# Altium schematic sheet Microcontroller CPU.SchDoc
size A4; SheetNumber: 2; SheetTotal: 5
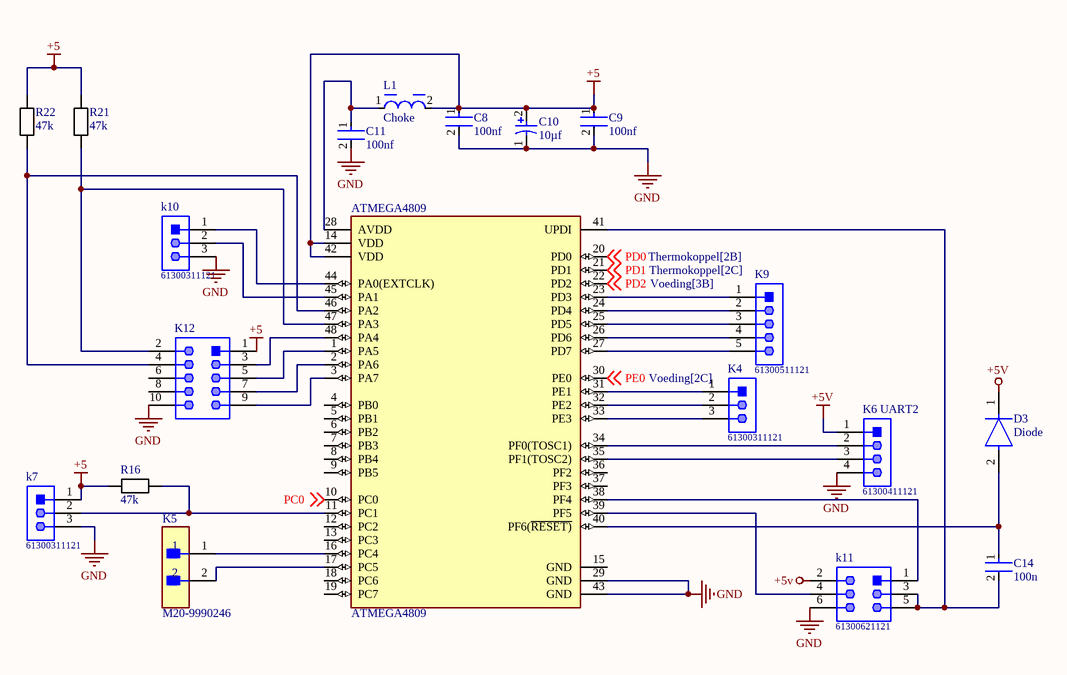
[diagram p0: Microcontroller CPU.SchDoc]

## Parts
ATMEGA4809  ATMEGA4809  [FP-C04-300-PT-IPC_B]
C8  100nf  [CC_0805_L]
C9  100nf  [CC_0805_L]
C10  10µf  [CE_D8_L10]
C11  100nf  [CC_0805_L]
C14  100n  [CC_0805_L]
D3  Diode  [SOD-123FL]
K4  61300311121  [pin header 1x3]
K5  M20-9990246  [pin header 1x2]
K6_UART2  61300411121  [pin header 1x4]
k7  61300311121  [pin header 1x3]
K9  61300511121  [pin header 1x5]
k10  61300311121  [pin header 1x3]
k11  61300621121  [pin header 2x6]
K12  (no value)  [box header 10-pin]
L1  Choke  [CC_0805_L]
R16  47k  [RESC2013X50X30ML20T20]
R21  47k  [RESC2013X50X30ML20T20]
R22  47k  [RESC2013X50X30ML20T20]

## Nets
+5: ATMEGA4809.14(VDD) ATMEGA4809.42(VDD) C8.1 C9.1 C10.2 k7.1 K12.1 L1.2 R16.1 R21.2 R22.2
+5V: D3.1(C) K6_UART2.1 k11.2
GND: ATMEGA4809.29(GND) ATMEGA4809.43(GND) C8.2 C9.2 C10.1 C11.2 K6_UART2.4 k7.3 k10.3 k11.6 K12.10
PC0: ATMEGA4809.10(PC0) ; off-sheet PC0
PD0: ATMEGA4809.20(PD0) ; off-sheet PD0
PD1: ATMEGA4809.21(PD1) ; off-sheet PD1
PD2: ATMEGA4809.22(PD2) ; off-sheet PD2
PE0: ATMEGA4809.30(PE0) ; off-sheet PE0
NetATMEGA4809_1: ATMEGA4809.1(PA5) K12.5
NetATMEGA4809_2: ATMEGA4809.2(PA6) K12.7
NetATMEGA4809_3: ATMEGA4809.3(PA7) K12.9
NetATMEGA4809_11: ATMEGA4809.11(PC1) k7.2 R16.2
NetATMEGA4809_16: ATMEGA4809.16(PC4) K5.1
NetATMEGA4809_17: ATMEGA4809.17(PC5) K5.2
NetATMEGA4809_23: ATMEGA4809.23(PD3) K9.1
NetATMEGA4809_24: ATMEGA4809.24(PD4) K9.2
NetATMEGA4809_25: ATMEGA4809.25(PD5) K9.3
NetATMEGA4809_26: ATMEGA4809.26(PD6) K9.4
NetATMEGA4809_27: ATMEGA4809.27(PD7) K9.5
NetATMEGA4809_28: ATMEGA4809.28(AVDD) C11.1 L1.1
NetATMEGA4809_31: ATMEGA4809.31(PE1) K4.1
NetATMEGA4809_32: ATMEGA4809.32(PE2) K4.2
NetATMEGA4809_33: ATMEGA4809.33(PE3) K4.3
NetATMEGA4809_34: ATMEGA4809.34(PF0(TOSC1)) K6_UART2.2
NetATMEGA4809_35: ATMEGA4809.35(PF1(TOSC2)) K6_UART2.3
NetATMEGA4809_38: ATMEGA4809.38(PF4) k11.1
NetATMEGA4809_39: ATMEGA4809.39(PF5) k11.4
NetATMEGA4809_40: ATMEGA4809.40(PF6(~{RESET)}) C14.1 D3.2(A)
NetATMEGA4809_41: ATMEGA4809.41(UPDI) C14.2 k11.3 k11.5
NetATMEGA4809_44: ATMEGA4809.44(PA0(EXTCLK)) k10.1
NetATMEGA4809_45: ATMEGA4809.45(PA1) k10.2
NetATMEGA4809_46: ATMEGA4809.46(PA2) K12.4 R22.1
NetATMEGA4809_47: ATMEGA4809.47(PA3) K12.2 R21.1
NetATMEGA4809_48: ATMEGA4809.48(PA4) K12.3

Not connected (* = marked no-connect by the designer): ATMEGA4809 4(PB0) 5(PB1) 6(PB2) 7(PB3) 8(PB4) 9(PB5) 12(PC2) 13(PC3) 15(GND) 18(PC6) 19(PC7) 36(PF2) 37(PF3); K12 6 8

## Library data of the parts
ATMEGA4809 = ATMEGA4809: Peripherals: Brown-out Detect/Reset; Number of I/Os: 41; Core Architecture: AVR; Memory Size: 48KB; Interface: I2C; Oscillator Type: Internal; Memory Type: FLASH; Series: megaAVR® 0, Functional Safety (FuSa); Min Operating Temperature: -40°C; Mount: Surface Mount; Case/Package: TQFP; RoHS Compliant: Yes; Max Operating Temperature: 85°C
C8 C9 C11 C14 = Capacitor_Ceramic: Manufacturer: KEMET; Manufacturer Part Number: C0805C224K5RACTU; Value: 0.22 μF; Temperature Characteristic: X7R; Temperature Coefficient: 30ppm/°C; Tolerance: 0.1; Voltage Rating: 50 V; ComponentLink2URL: https://content.kemet.com/datasheets/KEM_C1003_C0G_SMD.pdf; Device Class L3: Ceramic Capacitors; Lead Free: Yes; Temperature: -55°C to +125°C; RoHS: TRUE; Capacitance: 0.22 μF; Automotive: No; Material: Ceramic; Octopart: https://octopart.com/c0805c224k5ractu-kemet-144670; Temperature Range Low: -55°C; Height: 0.88mm; Device Class L1: Passive Components; Digikey Description: CAP CER 0.22UF 50V X7R 0805; ComponentLink2Description: Datasheet; Mouser Description: CAP CER 0.22UF 50V X7R 0805; Category: Cap; Ipc Land Pattern Name: CAPC200125X78; Temperature Range High: +125°C; Package: C0805C-DN; Device Class L2: Capacitors
C10 = Capacitor_Electrolytic: Manufacturer: Panasonic; Voltage Rating: 25 V; ComponentLink2URL: http://industrial.panasonic.com/cdbs/www-data/pdf/RDE0000/ABA0000C1181.pdf; Height: 10.2 mm; Max Operating Temperature: 105 degC; PackageReference: EEE-FK1E221P; ComponentLink1Description: Manufacturer URL; ComponentLink1URL: http://www.panasonic.com/; Mount: Surface Mount; REACH SVHC: No SVHC; Min Operating Temperature: -55 degC; ComponentLink2Description: Datasheet; DatasheetVersion: 03/2016; Length: 10.2 mm; RoHSCompliant: true; Packaging: Tape and Reel; Package Quantity: 500; Lead Pitch: 3.1 mm; Pins: 2; PackageDescription: 2-Pin Electrolytic Aluminum Capacitor, Body 8.3 x 8.3 mm; Mounting Technology: Surface Mount
D3 = Diode: Manufacturer Part Number: 1N4007; Manufacturer: Diotec; Max Surge Forward Current: 27A; Forward Current: 1A; Max Junction Temp: +175°C; Reverse Voltage: 1000V; Value: 15pF; Peak Reverse Current: 5uA; Category: Diode; Temperature Range Low: -50°C; Automotive: No; Temperature: -50°C to +175°C; Lead Free: Yes; ComponentLink2Description: Datasheet; Max Repetitive Reverse Voltage: 1000V; ComponentLink2URL: https://datasheet.octopart.com/1N4007-Diotec-datasheet-62346875.pdf; Device Class L3: Rectifier Diodes; Height: 2.8mm; Octopart: https://octopart.com/1n4007-diotec-4040411; Package: 1N4007; Temperature Range High: +175°C; Device Class L1: Discrete Semiconductors; Device Class L2: Diodes; RoHS: TRUE; Capacitance: 15pF; Ipc Land Pattern Name: DIOAD888W100L520D280
K4 k7 k10 = pin header 1x3pin: THT Vertical Pin Header WR-PHD, Pitch 2.54 mm, Single Row, 3 pins; Manufacturer: Wurth Elektronik; Withstanding Voltage: 500VAC; Working Voltage: 250VAC; Rated Current: 3A; Pitch: 2.54mm; Pin Number: 3; Gender: Male; Contact Resistance: 20mOhm; Package Reference: 61300311121; Manufacturer URL: http://www.we-online.de; Datasheet URL: https://katalog.we-online.de/em/datasheet/6130xx11121.pdf; Operating Temperature: -40to105degC; Part Number: 61300311121; Orientation: Vertical; Packaging: Bag; Row Number: Single; Mounting Technology: THT; Publisher: WurthElektronik
K5 = pin header 1x2: CONN HEADER VERT 2POS 2.54MM; Manufacturer: Harwin; Conn Gender: Male; Conn Orientation: Vertical; Number Of Contacts: 2; Current Rating: 3A; ComponentLink2URL: https://cdn.harwin.com/pdfs/M20-999.pdf; ComponentLink2Description: Datasheet; Package: M20-9990246; Temperature: -40°C to +105°C; Octopart: https://octopart.com/m20-9990246-harwin-2590635; Mouser Description: 2.54mm (0.1") Pitch SIL Vertical PC Tail Pin Header, 6.1mm mating pin height, tin, 2 contacts; Temperature Range High: +105°C; Device Class L1: Connectors; RoHS: TRUE; Automotive: No; Height: 8.99mm; Number Of Rows: 1; Contact Material: Tin,Nickel; Category: Conn; Pitch: 2.54mm; Lead Free: Yes; Digikey Description: CONN HEADER VERT 2POS 2.54MM; Manufacturer Part Number: M20-9990246; Temperature Range Low: -40°C; Device Class L3: unset; Device Class L2: Headers and Wire Housings
K6_UART2 = pin header 1x4: THT Vertical Pin Header WR-PHD, Pitch 2.54 mm, Single Row, 4 pins; Manufacturer: Wurth Elektronik; Withstanding Voltage: 500VAC; Rated Current: 3A; Working Voltage: 250VAC; Pin Number: 4; Gender: Male; Contact Resistance: 20mOhm; Pitch: 2.54mm; Manufacturer URL: http://www.we-online.de; Operating Temperature: -40to105degC; Packaging: Bag; Mounting Technology: THT; Package Reference: 61300411121; Datasheet URL: https://katalog.we-online.de/em/datasheet/6130xx11121.pdf; Publisher: WurthElektronik; Part Number: 61300411121; Row Number: Single; Orientation: Vertical
K9 = pin header 1x5: THT Vertical Pin Header WR-PHD, Pitch 2.54 mm, Single Row, 5 pins; Manufacturer: Wurth Elektronik; Pin Number: 5; Contact Resistance: 20mOhm; Working Voltage: 250VAC; Pitch: 2.54mm; Withstanding Voltage: 500VAC; Rated Current: 3A; Gender: Male; Datasheet URL: https://katalog.we-online.de/em/datasheet/6130xx11121.pdf; Orientation: Vertical; Mounting Technology: THT; Row Number: Single; Package Reference: 61300511121; Publisher: WurthElektronik; Part Number: 61300511121; Packaging: Bag; Manufacturer URL: http://www.we-online.de; Operating Temperature: -40to105degC
k11 = pin header 2x6: THT Vertical Pin Header WR-PHD, Pitch 2.54 mm, Dual Row, 6 pins; Manufacturer: Wurth Elektronik; Contact Resistance: 20mOhm; Withstanding Voltage: 500VAC; Pin Number: 6; Gender: Male; Pitch: 2.54mm; Working Voltage: 250VAC; Rated Current: 3A; Packaging: Bag; Row Number: Dual; Manufacturer URL: http://www.we-online.de; Part Number: 61300621121; Operating Temperature: -40to105degC; Mounting Technology: THT; Package Reference: 61300621121; Datasheet URL: https://katalog.we-online.de/em/datasheet/6130xx21121.pdf; Orientation: Vertical; Publisher: WurthElektronik
K12 = Box Header: Male Box Header WR-BHD, THT, Vertical, pitch 2.54 mm, 10 pins; Part Number: 61201021621; Manufacturer: Wurth Elektronik; Contact Resistance: 20mOhm; Withstanding Voltage: 500VAC; Pin Number: 10; Working Voltage: 250VAC; Pitch: 2.54mm; Mounting Technology: THT; Operating Temperature: -40to125degC; Published Date: August2018; Gender: Male; Packaging: Tray; Manufacturer URL: http://www.we-online.de; Datasheet URL: https://katalog.we-online.de/em/datasheet/6120xx21621.pdf; Orientation: Vertical; Package Reference: 61201021621; Publisher: WurthElektronik
L1 = Choke: Tolerance: 20%; Shielding: Shielded; Saturation Current: 10A; Test Frequency: 100kHz; RMS Current (Irms): 8.5A; Inductance: 10uH; Series Resistance: 14.1R; DC Resistance (DCR): 14.1mR; Self Resonant Frequency: 18MHz; Ratings: AEC-Q200; Width: 12.8mm; Series: WE-HCI; Length: 0.512inch; Mount: Surface Mount; Resistor Type: Wirewound; RoHS Compliant: Yes; Package Quantity: 1; Min Operating Temperature: -40°C; Inductance Tolerance: 20%; Termination: SMD/SMT; Max DC Current: 8.5A; Height - Seated (Max): 0.197inch; Case/Package: 1350; Current Rating: 8.5A; Max Operating Temperature: 155°C; Packaging: Tape and Reel; Height: 4.7mm
R16 R21 R22 = Weerstand: Manufacturer: Vishay Dale; Part Number: CRCW08050000Z0EA